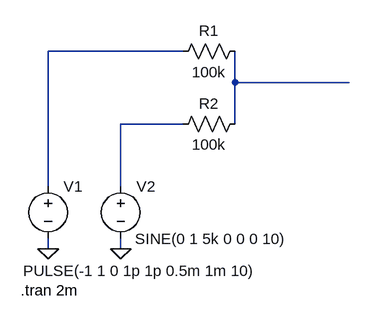
[diagram p0: schematic sumator_AC.asc]
sumator_AC.asc, the LTspice schematic file:
Version 4
SHEET 1 880 680
WIRE 224 -32 16 -32
WIRE 304 16 304 -32
WIRE 480 16 304 16
WIRE 224 80 128 80
WIRE 304 80 304 16
WIRE 16 176 16 -32
WIRE 128 176 128 80
WIRE 16 272 16 256
WIRE 128 272 128 256
FLAG 16 272 0
FLAG 128 272 0
SYMBOL res 320 -48 R90
WINDOW 0 0 56 VBottom 2
WINDOW 3 32 56 VTop 2
SYMATTR InstName R1
SYMATTR Value 100k
SYMBOL res 320 64 R90
WINDOW 0 0 56 VBottom 2
WINDOW 3 32 56 VTop 2
SYMATTR InstName R2
SYMATTR Value 100k
SYMBOL voltage 16 160 R0
WINDOW 3 -38 146 Left 2
WINDOW 123 0 0 Left 2
WINDOW 39 0 0 Left 2
SYMATTR InstName V1
SYMATTR Value PULSE(-1 1 0 1p 1p 0.5m 1m 10)
SYMBOL voltage 128 160 R0
WINDOW 3 22 97 Left 2
WINDOW 123 0 0 Left 2
WINDOW 39 0 0 Left 2
SYMATTR InstName V2
SYMATTR Value SINE(0 1 5k 0 0 0 10)
TEXT -26 336 Left 2 !.tran 2m

The netlist it stands for:
* sumator_AC.asc
R1 N002 N001 100k
R2 N002 N003 100k
V1 N001 0 PULSE(-1 1 0 1p 1p 0.5m 1m 10)
V2 N003 0 SINE(0 1 5k 0 0 0 10)
.tran 2m
.backanno
.end